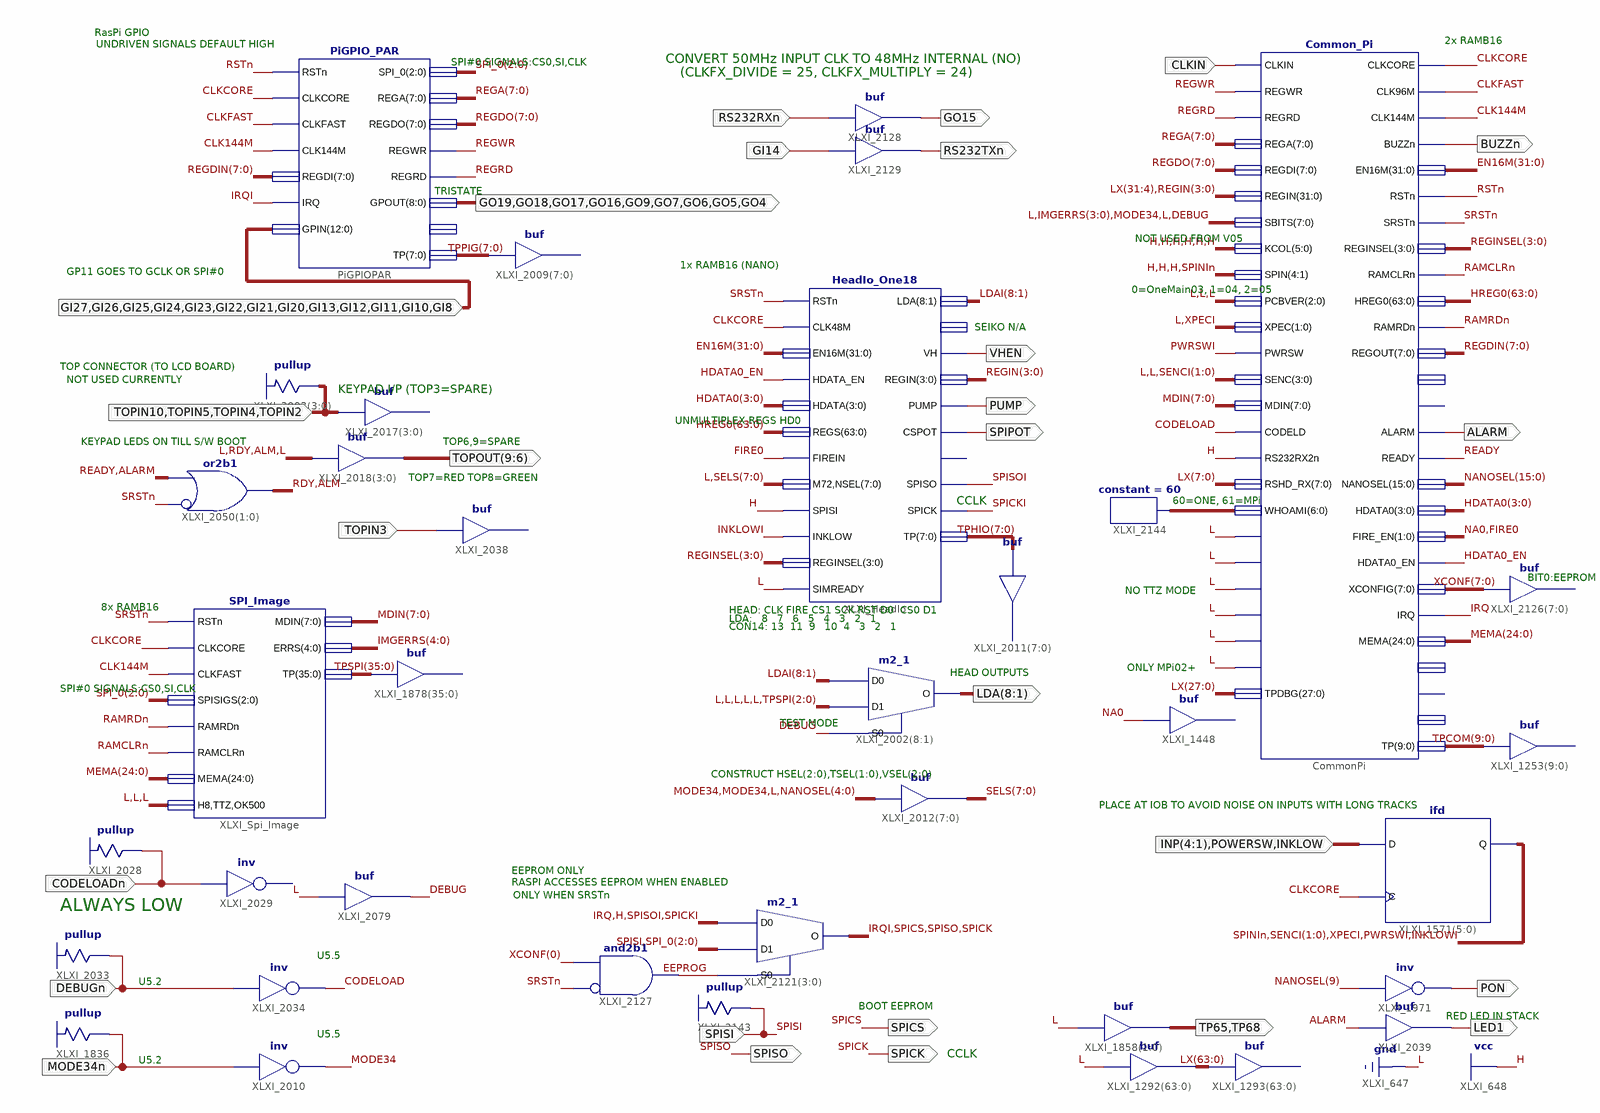
[diagram p0: schematic sheet 1]
// Xilinx ISE schematic OnePi_03.sch (spartan3e) as structural Verilog: 36 symbols, 27 ports
module OnePi_03 (
  input  MODE34n,
  input  GI27,
  input  GI26,
  input  GI25,
  input  GI24,
  input  GI23,
  input  GI22,
  input  GI21,
  input  GI20,
  input  GI13,
  input  GI12,
  input  GI11,
  input  GI10,
  input  GI8,
  input  TOPIN10,
  input  TOPIN5,
  input  TOPIN4,
  input  TOPIN2,
  input  DEBUGn,
  input  CODELOADn,
  input  TOPIN3,
  input  CLKIN,
  input  RS232RXn,
  input  GI14,
  input  SPISI,
  input  [4:1] INP,
  input  POWERSW,
  input  INKLOW,
  output ALARM,
  output [8:1] LDA,
  output SPISO,
  output SPICK,
  output [9:6] TOPOUT,
  output GO19,
  output GO18,
  output GO17,
  output GO16,
  output GO9,
  output GO7,
  output GO6,
  output GO5,
  output GO4,
  output GO15,
  output RS232TXn,
  output SPICS,
  output BUZZn,
  output LED1,
  output TP65,
  output TP68,
  output PON,
  output VHEN,
  output PUMP,
  output SPIPOT
);

  wire ALM, CLK144M, CLKCORE, CLKFAST, CODELOAD, DEBUG, EEPROG, FIRE0, HDATA0_EN, INKLOWI, IRQ, IRQI, MODE34,
       NA0, PWRSWI, RAMCLRn, RAMRDn, RDY, READY, REGRD, REGWR, RSTn, SPICKI, SPINIn, SPISOI, SRSTn, XPECI;
  wire [1:0] SENCI;
  wire [2:0] SPI_0;
  wire [3:0] HDATA0, REGIN, REGINSEL;
  wire [4:0] IMGERRS;
  wire [6:0] XLXN_12;
  wire [7:0] MDIN, REGA, REGDIN, REGDO, SELS, TPHIO, TPPIG, XCONF;
  wire [8:1] LDAI;
  wire [9:0] TPCOM;
  wire [15:0] NANOSEL;
  wire [24:0] MEMA;
  wire [31:0] EN16M;
  wire [35:0] TPSPI;
  wire [63:0] HREG0, LX;

  assign LX = {64{1'b0}};  // buf XLXI_1292[63..0], 64 bits wide
  // buf XLXI_1293[63..0] has open pins: I=LX, O=open
  \pullup  XLXI_1836 (.O(MODE34n));
  not XLXI_2010 (MODE34, MODE34n);
  m2_1 XLXI_2002[8:1] (.D0(LDAI), .D1({{5{1'b0}}, TPSPI[2:0]}), .S0(DEBUG), .O(LDA));
  assign SELS = {{2{MODE34}}, 1'b0, NANOSEL[4:0]};  // buf XLXI_2012[7..0], 8 bits wide
  // buf XLXI_2017[3..0] has open pins: I={TOPIN10, TOPIN5, TOPIN4, TOPIN2}, O=open
  assign TOPOUT = {1'b0, RDY, ALM, 1'b0};  // buf XLXI_2018[3..0], 4 bits wide
  \pullup  XLXI_2003[3:0] (.O({TOPIN10, TOPIN5, TOPIN4, TOPIN2}));
  \pullup  XLXI_2033 (.O(DEBUGn));
  not XLXI_2034 (CODELOAD, DEBUGn);
  \pullup  XLXI_2028 (.O(CODELOADn));
  assign {RDY, ALM} = ~{2{SRSTn}} | {READY, ALARM};  // or2b1 XLXI_2050[1..0], 2 bits wide
  // buf XLXI_2038 has open pins: I=TOPIN3, O=open
  // buf XLXI_2009[7..0] has open pins: I=TPPIG, O=open
  // inv XLXI_2029 has open pins: I=CODELOADn, O=open
  buf XLXI_2079 (DEBUG, 1'b0);
  buf XLXI_2128 (GO15, RS232RXn);
  buf XLXI_2129 (RS232TXn, GI14);
  m2_1 XLXI_2121[3:0] (
    .D0({IRQ, 1'b1, SPISOI, SPICKI}), .D1({SPISI, SPI_0}), .S0(EEPROG), .O({IRQI, SPICS, SPISO, SPICK}));
  and XLXI_2127 (EEPROG, ~SRSTn, XCONF[0]);  // and2b1
  \pullup  XLXI_2143 (.O(SPISI));
  constant #(.CValue("60")) XLXI_2144 (.O(XLXN_12));
  // buf XLXI_2126[7..0] has open pins: I=XCONF, O=open
  buf XLXI_2039 (LED1, ALARM);
  assign {TP65, TP68} = 2'b00;  // buf XLXI_1858[1..0], 2 bits wide
  not XLXI_1971 (PON, NANOSEL[9]);
  ifd XLXI_1571[5:0] (.C(CLKCORE), .D({INP, POWERSW, INKLOW}), .Q({SPINIn, SENCI, XPECI, PWRSWI, INKLOWI}));
  // buf XLXI_1253[9..0] has open pins: I=TPCOM, O=open
  // buf XLXI_1448 has open pins: I=NA0, O=open
  HeadIo_One18 XLXI_HeadIo (
    .CLK48M(CLKCORE), .CSPOT(SPIPOT), .EN16M(EN16M), .FIREIN(FIRE0), .HDATA(HDATA0), .HDATA_EN(HDATA0_EN),
    .INKLOW(INKLOWI), .LDA(LDAI), .M72(1'b0), .NSEL(SELS), .PUMP(PUMP), .REGIN(REGIN), .REGINSEL(REGINSEL),
    .REGS(HREG0), .RSTn(SRSTn), .SIMREADY(1'b0), .SPICK(SPICKI), .SPISI(1'b1), .SPISO(SPISOI), .TP(TPHIO),
    .VH(VHEN));  // open: CSTHM, SCON
  // buf XLXI_2011[7..0] has open pins: I=TPHIO, O=open
  SPI_Image XLXI_Spi_Image (
    .CLKCORE(CLKCORE), .CLKFAST(CLK144M), .ERRS(IMGERRS), .H8(1'b0), .TTZ(1'b0), .OK500(1'b0), .MDIN(MDIN),
    .MEMA(MEMA), .RAMCLRn(RAMCLRn), .RAMRDn(RAMRDn), .RSTn(SRSTn), .SPISIGS(SPI_0), .TP(TPSPI));
  // buf XLXI_1878[35..0] has open pins: I=TPSPI, O=open
  PiGPIO_PAR PiGPIOPAR (
    .CLK144M(CLK144M), .CLKCORE(CLKCORE), .CLKFAST(CLKFAST),
    .GPIN({GI27, GI26, GI25, GI24, GI23, GI22, GI21, GI20, GI13, GI12, GI11, GI10, GI8}),
    .GPOUT({GO19, GO18, GO17, GO16, GO9, GO7, GO6, GO5, GO4}), .IRQ(IRQI), .REGA(REGA), .REGDI(REGDIN),
    .REGDO(REGDO), .REGRD(REGRD), .REGWR(REGWR), .RSTn(RSTn), .SPI_0(SPI_0), .TP(TPPIG));  // open: LASTWR
  Common_Pi CommonPi (
    .ALARM(ALARM), .BUZZn(BUZZn), .CLK144M(CLK144M), .CLK96M(CLKFAST), .CLKCORE(CLKCORE), .CLKIN(CLKIN),
    .CODELD(CODELOAD), .EN16M(EN16M), .FIRE_EN({NA0, FIRE0}), .HDATA0(HDATA0), .HDATA0_EN(HDATA0_EN),
    .HREG0(HREG0), .IRQ(IRQ), .ISCLK48M(1'b0), .KCOL({6{1'b1}}), .MASTERPI(1'b0), .MDIN(MDIN), .MEMA(MEMA),
    .NANOSEL(NANOSEL), .OK_500(1'b0), .OK_RASOFF(1'b0), .OK_RS232(1'b0), .OK_RSHEAD(1'b0), .PCBVER(3'b000),
    .PWRSW(PWRSWI), .RAMCLRn(RAMCLRn), .RAMRDn(RAMRDn), .READY(READY), .REGA(REGA), .REGDI(REGDO),
    .REGIN({LX[31:4], REGIN}), .REGINSEL(REGINSEL), .REGOUT(REGDIN), .REGRD(REGRD), .REGWR(REGWR),
    .RS232RX2n(1'b1), .RSHD_RX(LX[7:0]), .RSTn(RSTn), .SENC({2'b00, SENCI}), .SPIN({3'b111, SPINIn}),
    .SRSTn(SRSTn), .TP(TPCOM), .SBITS({1'b0, IMGERRS[3:0], MODE34, 1'b0, DEBUG}), .WHOAMI(XLXN_12),
    .XCONFIG(XCONF), .XPEC({1'b0, XPECI}), .TPDBG(LX[27:0]));  // open: KROW, RS232TX2n, SPOUT, TTZMODE, H8MODE, TX

  // Notes on the sheet:
  //   RasPi GPIO
  //   2x RAMB16
  //   UNDRIVEN SIGNALS DEFAULT HIGH
  //   CONVERT 50MHz INPUT CLK TO 48MHz INTERNAL (NO)
  //   SPI#0 SIGNALS:CS0,SI,CLK
  //   (CLKFX_DIVIDE = 25, CLKFX_MULTIPLY = 24)
  //   TRISTATE
  //   NOT USED FROM V05
  //   1x RAMB16 (NANO)
  //   GP11 GOES TO GCLK OR SPI#0
  //   0=OneMain03, 1=04, 2=05
  //   SEIKO N/A
  //   TOP CONNECTOR (TO LCD BOARD)
  //   NOT USED CURRENTLY
  //   KEYPAD I/P (TOP3=SPARE)
  //   UNMULTIPLEX REGS HD0
  //   KEYPAD LEDS ON TILL S/W BOOT
  //   TOP6,9=SPARE
  //   TOP7=RED TOP8=GREEN
  //   CCLK
  //   60=ONE, 61=MPi
  //   BIT0:EEPROM
  //   NO TTZ MODE
  //   8x RAMB16
  //   HEAD: CLK FIRE CS1 SCK RST D0  CS0 D1
  //   LDA:   8   7   6   5   4   3   2   1
  //   CON14: 13  11  9   10  4   3   2   1
  //   ONLY MPi02+
  //   HEAD OUTPUTS
  //   SPI#0 SIGNALS:CS0,SI,CLK
  //   TEST MODE
  //   CONSTRUCT HSEL(2:0),TSEL(1:0),VSEL(2:0)
  //   PLACE AT IOB TO AVOID NOISE ON INPUTS WITH LONG TRACKS
  //   EEPROM ONLY
  //   RASPI ACCESSES EEPROM WHEN ENABLED
  //   ONLY WHEN SRSTn
  //   ALWAYS LOW
  //   U5.5
  //   U5.2
  //   BOOT EEPROM
  //   RED LED IN STACK
  //   U5.5
  //   CCLK
  //   U5.2
endmodule
